# EAGLE design buck converter (EAGLE 6.5.0)
AUTHOR: A.Pullin; REVISION: A; YEAR: 2014
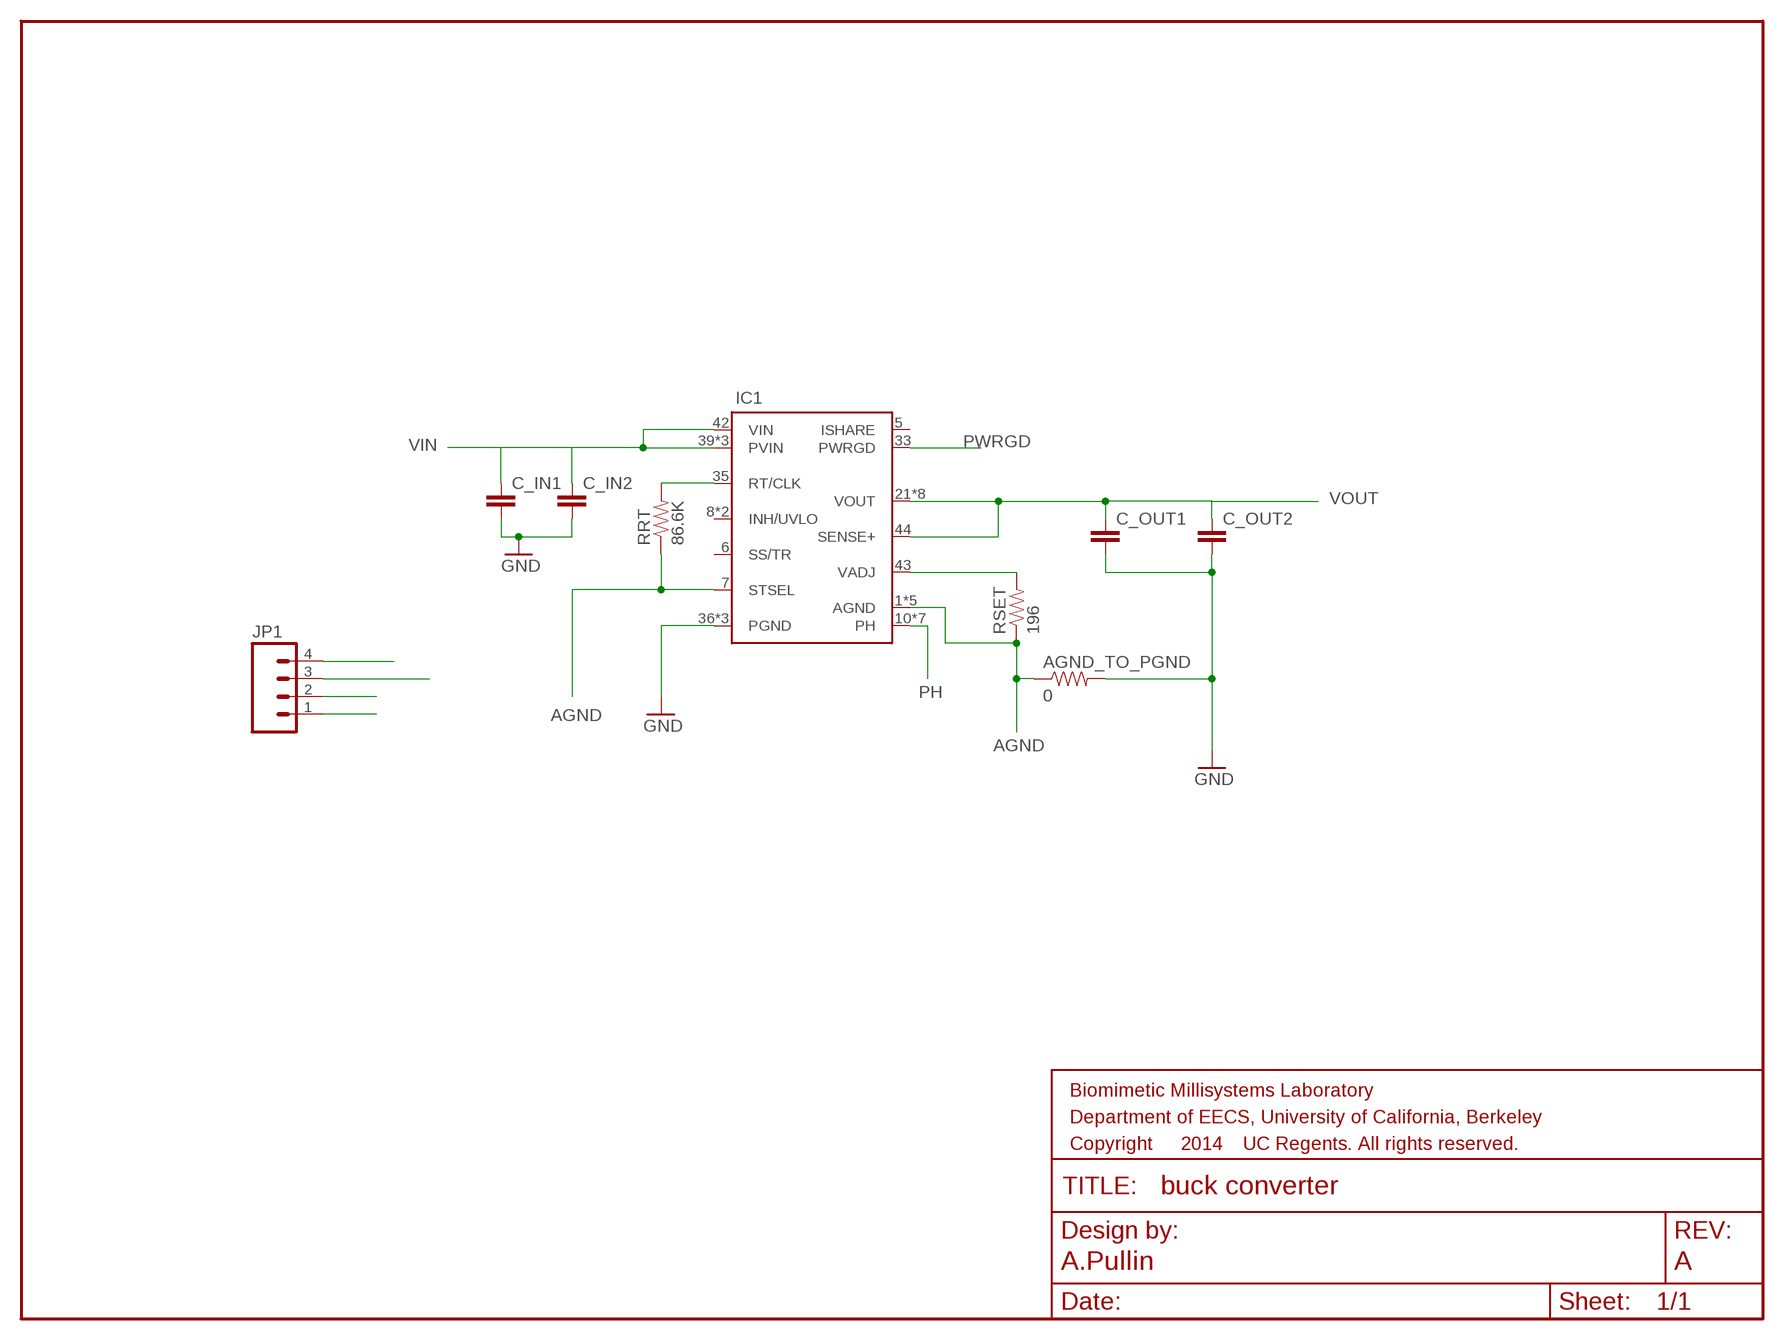
[diagram p0: schematic, sheet 1]

## Parts
AGND_TO_PGND  0  RESISTOR0402-RES  [0402-RES]
C_IN1  CAP1210  [1210]
C_IN2  CAP1210  [1210]
C_OUT1  CAP1210  [1210]
C_OUT2  CAP1210  [1210]
IC1  TPS84621  [TPS84621]
JP1  M04PTH  [1X04]
RRT  86.6K  RESISTOR0402-RES  [0402-RES]
RSET  196  RESISTOR0402-RES  [0402-RES]

## Nets
AGND: AGND_TO_PGND.1 IC1.1(AGND) IC1.2(AGND) IC1.7(STSEL) IC1.34(AGND) IC1.45(AGND) IC1.45B(AGND) RRT.1 RSET.1
GND: AGND_TO_PGND.2 C_IN1.2 C_IN2.2 C_OUT1.2 C_OUT2.2 IC1.36(PGND) IC1.37(PGND) IC1.38(PGND) JP1.2
N$1: IC1.35(RT/CLK) RRT.2
N$4: IC1.43(VADJ) RSET.2
PH: IC1.10(PH) IC1.11(PH) IC1.12(PH) IC1.13(PH) IC1.14(PH) IC1.17(PH) IC1.46(PH)
PWRGD: IC1.33(PWRGD) JP1.4
VIN: C_IN1.1 C_IN2.1 IC1.39(PVIN) IC1.40(PVIN) IC1.41(PVIN) IC1.42(VIN) JP1.1
VOUT: C_OUT1.1 C_OUT2.1 IC1.21(VOUT) IC1.24(VOUT) IC1.25(VOUT) IC1.26(VOUT) IC1.27(VOUT) IC1.28(VOUT) IC1.29(VOUT) IC1.44(SENSE+) IC1.47(VOUT) JP1.3
Unconnected: IC1.5(ISHARE) IC1.6(SS/TR) IC1.8(INH/UVLO) IC1.9(INH/UVLO)

## Library data of the parts
AGND_TO_PGND RRT RSET = biomimetic:RESISTOR: Resistor Basic schematic elements and footprints for 0603, 1206, and PTH resistors.
C_IN1 C_IN2 C_OUT1 C_OUT2 = biomimetic:CAP: Capacitor Standard 0603 ceramic capacitor, and 0.1" leaded capacitor.
IC1 = zumy:TPS84621
JP1 = SparkFun-Connectors:M04: Header 4 Standard 4-pin 0.1" header. Use with straight break away headers (SKU : PRT-00116), right angle break away headers (PRT-00553), swiss pins (PRT-00743), machine pins (PRT-00117), and female headers (PRT-00115). Molex polarized connector foot print use with SKU : PRT-08231 with associated crimp pins and housings. 1MM SMD Version SKU: PRT-10208

## Board
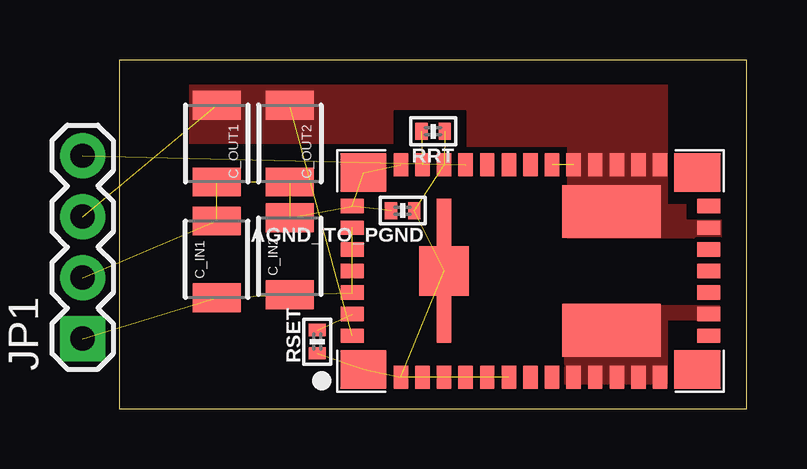
[diagram p1: board, top side]

Size 26.14 x 14.53 mm. Coordinates in mm from the lower left corner, seen from the top.
Outline: 0,0 26.14,0 26.14,14.53 0,14.53 0,0
Copper layers (1*16): Top 0.035mm / dielectric 1.5mm / Bottom 0.035mm
Design rules "default": minimum track width 10mil, minimum drill 24mil, track to track 8mil, track to pad 8mil, pad to pad 8mil, via to via 8mil, smd to smd 8mil, copper to edge 40mil, drill to drill 8mil, minimum pad ring 10mil, minimum via ring 8mil, stop-mask expansion 4mil, vias tented up to drill 0mil, thermal gap 10mil

### Footprints (pad centres in the part's own frame; a part is rotated, then mirrored left to right if it is on the bottom)
0402-RES = smd 0.508 x 0.711: 1 -0.483,0; 2 0.483,0
1210 = smd 1.2 x 2: 1 -1.6,0; 2 1.6,0
TPS84621 = smd 1.9 x 1.6: 1 -5.05,-5.725; 15 8.85,-5.725; 23 8.85,2.475; 37 -5.05,2.475 | smd 0.6 x 0.95: 2 -3.5,-6.05; 3 -2.6,-6.05; 4 -1.7,-6.05; 5 -0.8,-6.05; 6 0.1,-6.05; 7 1,-6.05; 8 1.9,-6.05; 9 2.8,-6.05; 10 3.7,-6.05; 11 4.6,-6.05; 12 5.5,-6.05; 13 6.4,-6.05; 14 7.3,-6.05; 24 7.3,2.8; 25 6.4,2.8; 26 5.5,2.8; 27 4.6,2.8; 28 3.7,2.8; 29 2.8,2.8; 30 1.9,2.8; 31 1,2.8; 32 0.1,2.8; 33 -0.8,2.8; 34 -1.7,2.8; 35 -2.6,2.8; 36 -3.5,2.8 | smd 0.95 x 0.6: 16 9.325,-4.325; 17 9.325,-3.425; 18 9.325,-2.525; 19 9.325,-1.625; 20 9.325,-0.725; 21 9.325,0.175; 22 9.325,1.075; 38 -5.525,1.075; 39 -5.525,0.175; 40 -5.525,-0.725; 41 -5.525,-1.625; 42 -5.525,-2.525; 43 -5.525,-3.425; 44 -5.525,-4.325 | smd 2.05 x 2.05: 45 -1.7,-1.625 | smd 0.6 x 6: 45B -1.7,-1.625 | smd 4.1 x 2.2: 46 5.275,-4.1; 47 5.275,0.85
1X04 = drill 1.016 pad 1.88 square: 1 0,0 | drill 1.016 pad 1.88: 2 2.54,0; 3 5.08,0; 4 7.62,0

### Placement (x,y rotation side)
AGND_TO_PGND  11.81,8.26 180 top
C_IN1  4.06,6.22 90 top
C_IN2  7.11,6.35 90 top
C_OUT1  4.06,11.05 270 top
C_OUT2  7.11,11.05 270 top
IC1  15.24,7.37 0 top
JP1  -1.52,2.92 90 top
RRT  13.08,11.56 180 top
RSET  8.26,2.79 90 top

### Tracks (layer width: path | path; a pad name or v marks a point on that pad's centre or on a via)
AGND  (7 unrouted)
GND  (8 unrouted)
N$1  (1 unrouted)
N$4  (1 unrouted)
PH
  pour Top (no thermals): 18.54,4.32 25.02,4.32 25.02,3.68 22.86,3.68 22.86,0.38 18.54,0.38
PWRGD  (1 unrouted)
VIN  (6 unrouted)
VOUT  (3 unrouted)
  pour Top (no thermals): 18.67,11.94 18.67,7.11 25.27,7.11 25.27,7.87 23.62,7.87 23.62,8.51 22.86,8.51 22.86,11.94
  pour Top (no thermals): 18.67,10.92 14.48,10.92 14.48,12.45 8.51,12.45 8.51,11.94 2.92,11.94 2.92,13.59 22.86,13.59 22.86,10.92
  pour Top (no thermals): 2.92,12.45 2.92,11.05 11.43,11.05 11.43,12.45